# EasyEDA Pro project jlcProject.epro, schematic Schematic5
Create Date: 2025-04-10; Page Name: P1; Project Name: 电综; Schematic Name: Schematic5; Update Date: 2025-04-13; Company: 嘉立创EDA; Page Size: A4; Version: V1.0
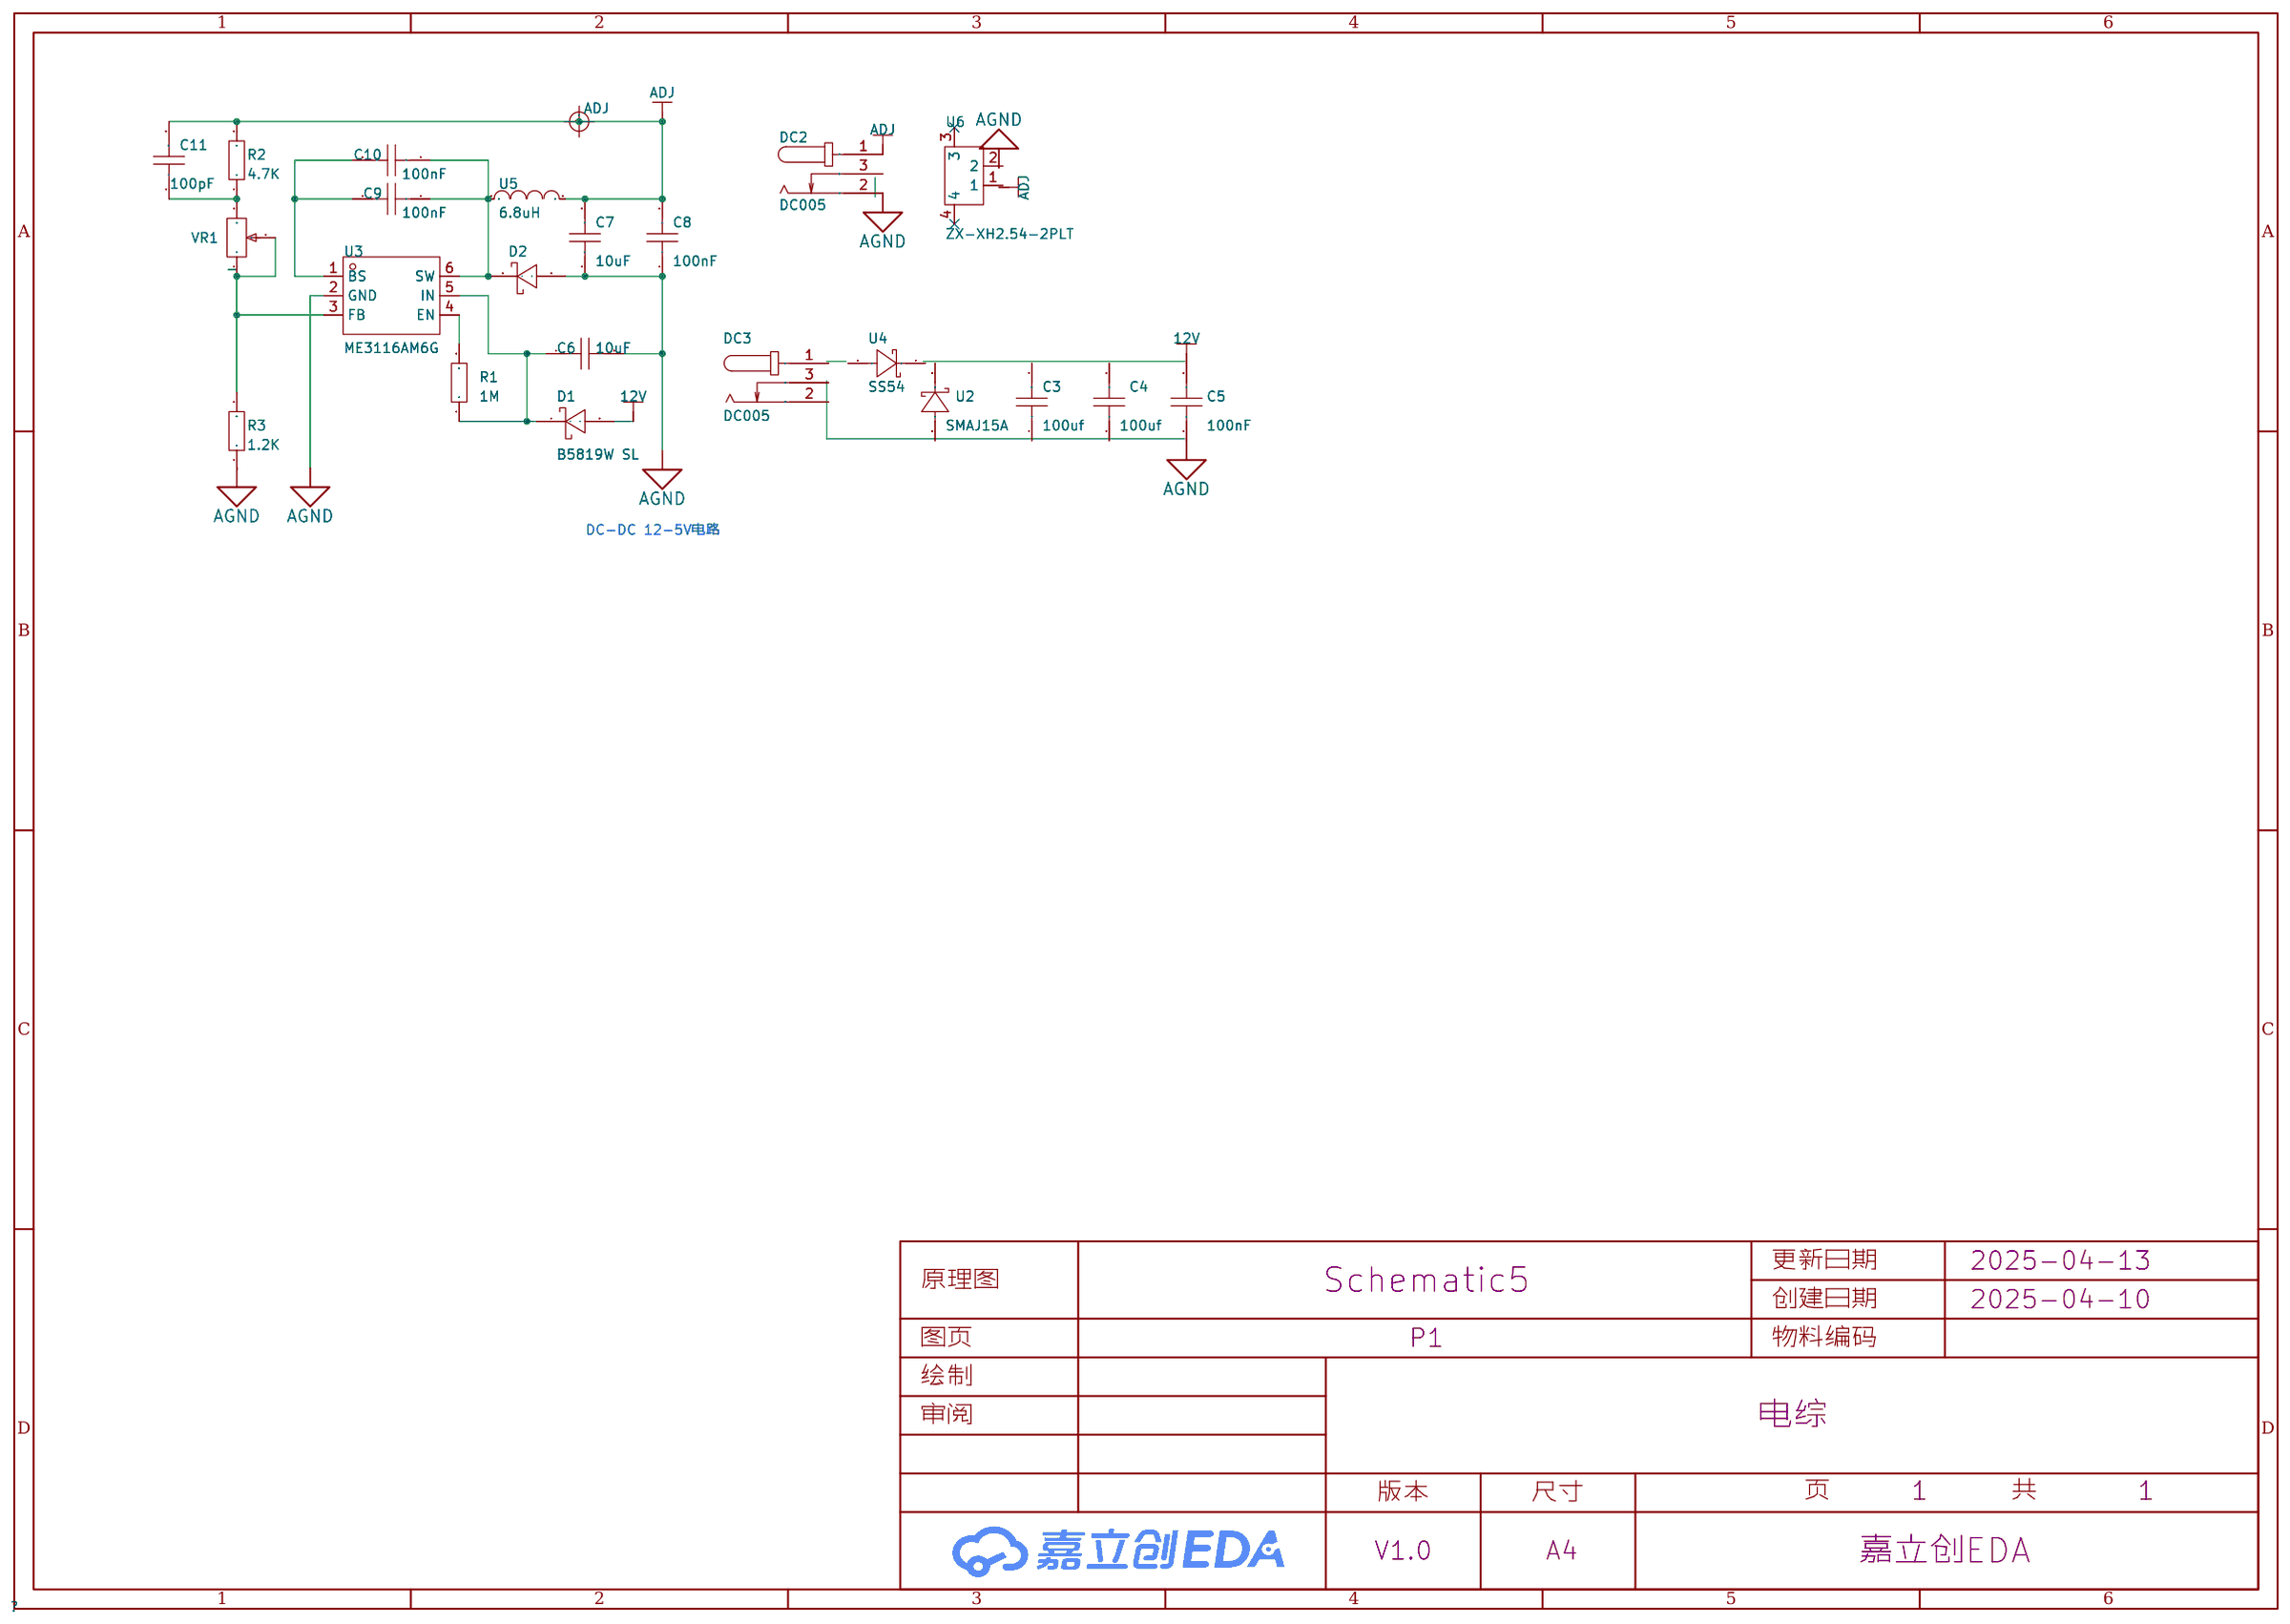
[diagram p2: schematic sheet]

## Parts
ADJ  -  [Mark-Point-1mm]  (no BOM)
C3  100uf  [C1206]
C4  100uf  [C1206]
C5  100nF  [C0805]
C6  10uF  [C0805]
C7  10uF  [C0805]
C8  100nF  [C0805]
C9  100nF  [C0805]
C10  100nF  [C0805]
C11  100pF  [C0805]
D1  B5819W SL  [SOD-123_L2.7-W1.6-LS3.7-RD-1]
D2  B5819W SL  [SOD-123_L2.7-W1.6-LS3.7-RD-1]
DC2  DC005  [DC-IN-TH_DC005]
DC3  DC005  [DC-IN-TH_DC005]
R1  1M  [R0805]
R2  4.7K  [R0805]
R3  1.2K  [R0805]
U2  SMAJ15A  [DO-214AC_L4.6-W2.8-LS5.6-RD]
U3  ME3116AM6G  [SOT-23-6_L2.9-W1.6-P0.95-LS2.8-BL]
U4  SS54  [SMA_L4.2-W2.6-LS5.1-RD]
U5  6.8uH  [IND-SMD_L7.2-W6.6_GPSR07X0]
U6  ZX-XH2.54-2PLT  [CONN-SMD_2P-P2.50_HCTL_HC-XH-2ALT]
VR1  -  [RES-ADJ-TH_3296W]

## Library data of the parts
ADJ = Mark-Point: Mark点
C3 C4 = CAP_1206: Supplier Footprint: 1206
C5-C11 = CAP_0805: Supplier Footprint: 0805
D1 D2 = B5819W SL: 正向压降(Vf):600mV@1A;直流反向耐压(Vr):40V;整流电流:1A;; LCSC Part Name: 电压:40V 电流:1A; Supplier Part: C8598; Manufacturer: CJ(江苏长电/长晶); Supplier Footprint: SOD-123; JLCPCB Part Class: 基础库; Datasheet: https://atta.szlcsc.com/upload/public/pdf/source/20171228/C164911_15144413243851213914.pdf; Supplier: LCSC; Forward Voltage (Vf@If): 600mV@1A; Reverse Voltage (Vr): 40V; Rectified Current: 1A
DC2 DC3 = DC005: 连接器类型:DC电源插座;安装方式:弯插;触点内径:2mm;触点外径:6.3mm;额定电流:500mA;额定电压:30V;工作温度范围:-25℃~+70℃;; LCSC Part Name: DC电源插座 内径:2mm 外径:6.3mm; Supplier Part: C431533; Manufacturer: SHOU HAN(首韩); Supplier Footprint: 插件; JLCPCB Part Class: Extended Part; Datasheet: https://atta.szlcsc.com/upload/public/pdf/source/20190925/C431533_4751811035784AC1D38EBC85F7905E99.pdf; Supplier: LCSC; Connector Type: DC电源插座; Mounting Style: 弯插; Inside Contact Diameter: 2mm; Outside Contact Diameter: 6.3mm; Current Rating (Max): 500mA; Voltage Rating (Max): 30V; Operating Temperature Range: -25℃~+70℃
R1-R3 = Res_0805: Supplier Footprint: 0805
U2 = SMAJ15A_C5339847: 极性:单向;反向截止电压(Vrwm):15V;最大钳位电压:24.4V;峰值脉冲电流(Ipp):16.39A;峰值脉冲功率(Ppp):400W;击穿电压:16.7V;; Supplier Part: C5339847; Manufacturer: YANGJIE(扬杰); Supplier Footprint: SMA(DO-214AC); JLCPCB Part Class: Extended Part; Datasheet: https://atta.szlcsc.com/upload/public/pdf/source/20240417/078E1BEAC4554065E7AD0D3CFE8DBE37.pdf; Supplier: LCSC; polarity: 单向; Reverse Stand-Off Voltage (Vrwm): 15V; Maximum Clamping Voltage: 24.4V; Peak Pulse Current (Ipp): 16.39A; Peak Pulse Power Dissipation (Ppp): 400W; Breakdown Voltage: 16.7V; Type: TVS
U3 = ME3116AM6G: Supplier Part: C427569; Supplier Footprint: SOT-23-6; JLCPCB Part Class: Extended Part; Supplier: LCSC
U4 = SS54: Supplier Part: C9900023219; Supplier Footprint: (1N5824)DO-214; JLCPCB Part Class: 扩展库; Supplier: LCSC
U5 = CYA0630-4.7UH: 电感值:4.7uH;精度:±20%;额定电流:5A;直流电阻(DCR):34.5mΩ;; LCSC Part Name: 4.7uH ±20%; Supplier Part: C5189748; Manufacturer: SHOU HAN(首韩); Supplier Footprint: SMD,7.2x6.6mm; JLCPCB Part Class: Extended Part; Datasheet: https://atta.szlcsc.com/upload/public/pdf/source/20221010/79ACBE86DD414F23A670753564343C1B.pdf; Supplier: LCSC; Tolerance: ±20%; Rated Current: 5A; DC Resistance (DCR): 34.5mΩ
U6 = ZX-XH2.54-2PLT: 插针结构:1x2P;间距:2.5mm;安装方式:立贴;参考系列:XH;总PIN数:2P;排数:1;每排PIN数:2;行距:-;额定电流:-;触头材质:黄铜;触头镀层:锡;工作温度:-;; LCSC Part Name: 1x2P 间距:2.5mm 立贴 系列:XH; Supplier Part: C7429680; Manufacturer: Megastar(兆星); Supplier Footprint: SMD,P=2.5mm; JLCPCB Part Class: 扩展库; Datasheet: https://atta.szlcsc.com/upload/public/pdf/source/20230619/87C018EBE425F10E4B035B436CF5FBBC.pdf; Supplier: LCSC; Pins Structure: 1x2P; Pitch: 2.5mm; Mounting Type: 立贴; Reference Series: XH; Number of Pins: 2P; Number of Rows: 1; Number of PINs Per Row: 2; Contact Material: 黄铜; Contact Plating: 锡; Supplementary Features: 辅助焊脚; Color: 米色; Z-Height of the Board: 8mm; X-Length of Bottom Edge on Board (Spacing Line): 10mm; Y-Width of Bottom Edge on Board: 8.3mm
VR1 = 3296W-1-104_C5035: 阻值:-;功率:-;; LCSC Part Name: 100KΩ; Supplier Part: C5035; Manufacturer Part: 3296W-1-104; Supplier Footprint: VR-3296W; JLCPCB Part Class: 扩展库; Supplier: LCSC

## Nets
12V: C5.2 D1.2(+)
AGND: C5.1 C6.2 C7.1 C8.1 D2.2(+) DC2.2 R3.1 U3.2(GND)
ADJ: ADJ.1 C7.2 C8.2 C11.2 DC2.1 R2.2 U5.2
$1N472: R1.2 U3.4(EN)
$1N473: C6.1 D1.1(-) R1.1 U3.5(IN)
$1N475: C9.1 C10.1 U3.1(BS)
$1N476: C9.2 C10.2 D2.1(-) U3.6(SW) U5.1
$1N1969: C11.1 R2.1 VR1.3
$1N1980: R3.2 U3.3(FB) VR1.1 VR1.2

Not connected (* = marked no-connect by the designer): C3 1 2; C4 1 2; DC2 3; DC3 1 2 3; U2 1(C) 2(A); U4 1(C) 2(A); U6 1 2 3* 4*

## Notes on the sheet
- DC-DC 12-5V电路
